# EAGLE design BNC-V003 (EAGLE 6.5.0)
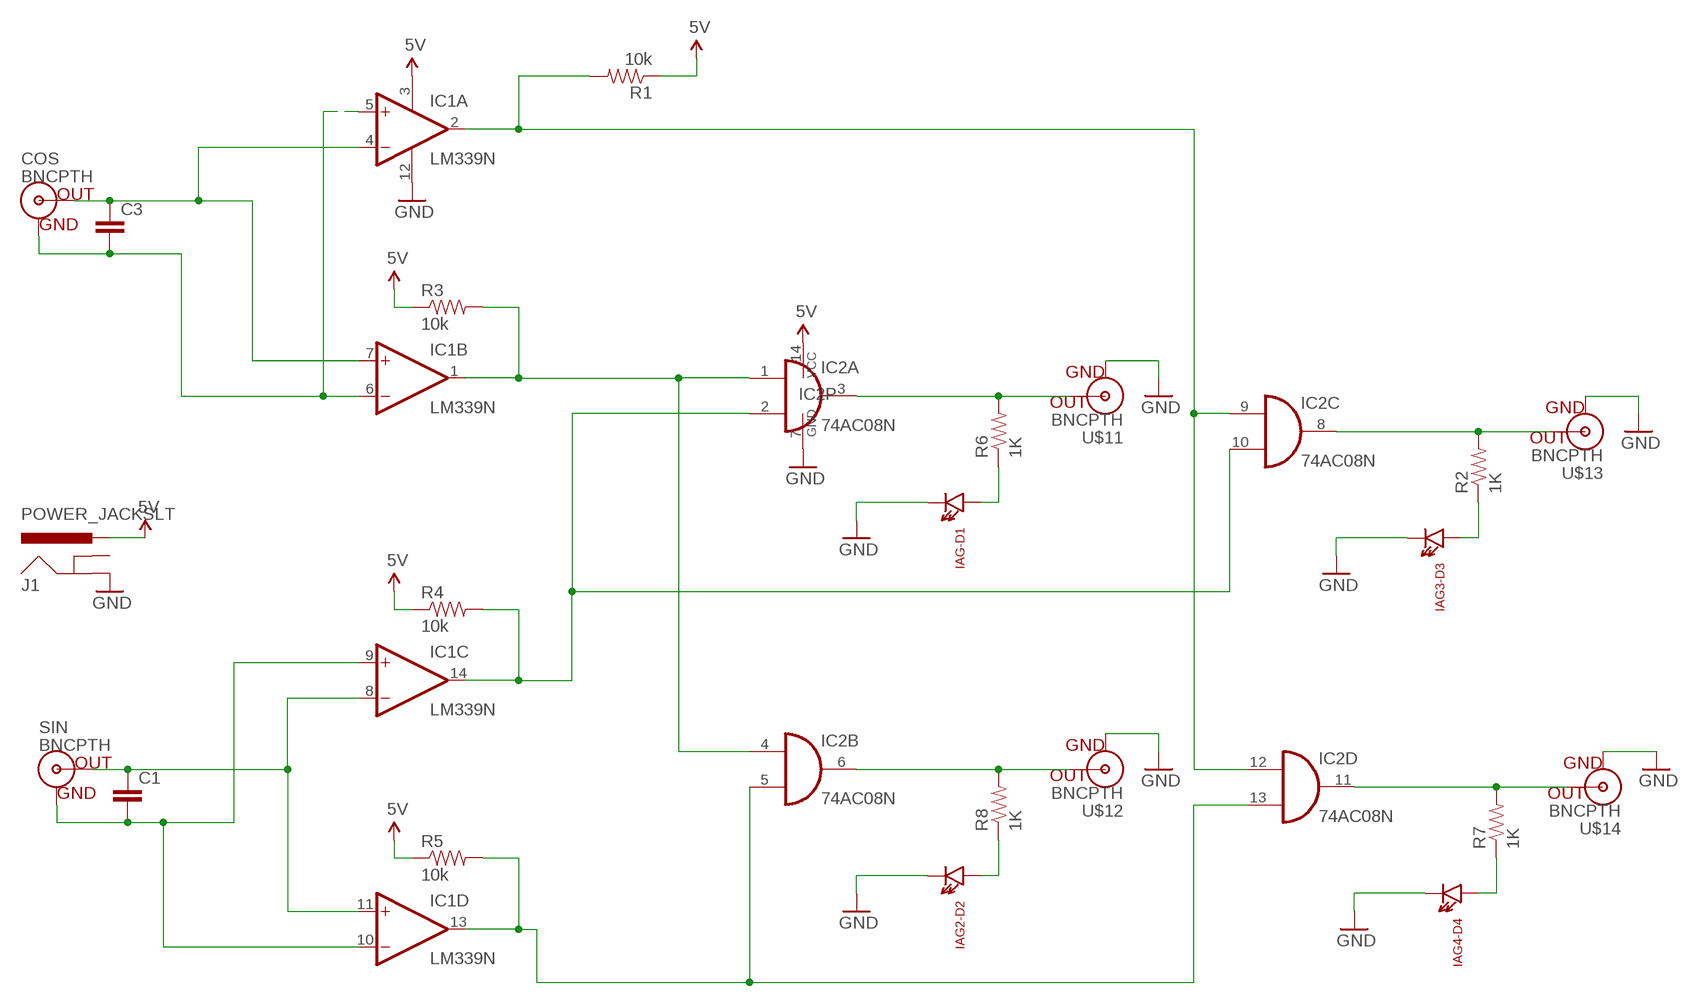
[diagram p0: schematic, sheet 1]

## Parts
C1  0.1UF-50V-20%(PTH)KIT-EZ  [CAP-PTH-SMALL-KIT]
C3  0.1UF-50V-20%(PTH)KIT-EZ  [CAP-PTH-SMALL-KIT]
COS  BNCPTH  [BNC]
IAG2-D2  LTE-302  [LTE-302]
IAG3-D3  LTE-302  [LTE-302]
IAG4-D4  LTE-302  [LTE-302]
IAG-D1  LTE-302  [LTE-302]
IC1  LM339N  [DIL14]
IC2  74AC08N  [DIL14]
J1  POWER_JACKSLT  [POWER_JACK_SLOT]
R1  10k  10KOHM-1/4W-1%(PTH)HORIZ  [AXIAL-0.3]
R2  1K  1KOHM-1/4W-1%(PTH)  [AXIAL-0.3]
R3  10k  10KOHM-1/4W-1%(PTH)HORIZ  [AXIAL-0.3]
R4  10k  10KOHM-1/4W-1%(PTH)HORIZ  [AXIAL-0.3]
R5  10k  10KOHM-1/4W-1%(PTH)HORIZ  [AXIAL-0.3]
R6  1K  1KOHM-1/4W-1%(PTH)  [AXIAL-0.3]
R7  1K  1KOHM-1/4W-1%(PTH)  [AXIAL-0.3]
R8  1K  1KOHM-1/4W-1%(PTH)  [AXIAL-0.3]
SIN  BNCPTH  [BNC]
U$11  BNCPTH  [BNC]
U$12  BNCPTH  [BNC]
U$13  BNCPTH  [BNC]
U$14  BNCPTH  [BNC]

## Nets
5V: IC1.3(P:V+) IC2.14(P:VCC) J1.PWR R1.P$1 R3.P$1 R4.P$1 R5.P$1
GND: IAG2-D2.C IAG3-D3.C IAG4-D4.C IAG-D1.C IC1.12(P:GND) IC2.7(P:GND) J1.GND@2(GND) U$11.GND U$12.GND U$13.GND U$14.GND
N$1: IC1.2(A:OUT) IC2.9(C:I0) IC2.12(D:I0) R1.P$2
N$2: IC2.11(D:O) R7.P$2 U$14.S(OUT)
N$3: IAG4-D4.A R7.P$1
N$4: IC1.1(B:OUT) IC2.1(A:I0) IC2.4(B:I0) R3.P$2
N$5: IC1.14(C:OUT) IC2.2(A:I1) IC2.10(C:I1) R4.P$2
N$6: IC1.13(D:OUT) IC2.5(B:I1) IC2.13(D:I1) R5.P$2
N$7: C3.2 COS.GND IC1.5(A:+IN) IC1.6(B:-IN)
N$8: C3.1 COS.S(OUT) IC1.4(A:-IN) IC1.7(B:+IN)
N$9: C1.1 IC1.8(C:-IN) IC1.11(D:+IN) SIN.S(OUT)
N$11: C1.2 IC1.9(C:+IN) IC1.10(D:-IN) SIN.GND
N$12: IC2.8(C:O) R2.P$2 U$13.S(OUT)
N$13: IAG3-D3.A R2.P$1
N$14: IC2.6(B:O) R8.P$2 U$12.S(OUT)
N$15: IAG2-D2.A R8.P$1
N$16: IC2.3(A:O) R6.P$2 U$11.S(OUT)
N$17: IAG-D1.A R6.P$1
Unconnected: J1.GND@1(GNDBREAK)

## Library data of the parts
C1 C3 = SparkFun-Capacitors:0.1UF-50V-20%(PTH): CAP-08370; PROD_ID: CAP-08370
COS SIN U$11-U$14 = SparkFun-Connectors:BNC: BNC Connector, Mouser Part# 5227161
IAG2-D2 IAG3-D3 IAG4-D4 IAG-D1 = SparkFun-LED:LTE-302: Through-hole side-firing 940nm IR LED
IC1 = linear:LM339: Low Power Low Offset Voltage Quad Comparators with open collector; LM139/LM239/LM339/LM2901/LM3302
IC2 = 74xx-eu:74*08: Quad 2-input AND gate
J1 = SparkFun-Connectors:POWER_JACK: Power Jack This is the standard 5.5mm barrel jack for power. The PTH is the most common, proven, reliable, footprint. The Slot footprint only works if the mill layer is transmitted to the PCB fab house so be warned. Mating wall wart : TOL-00298 (and others); PROD_ID: PRT-00119
R1 R3-R5 = SparkFun-Resistors:10KOHM-1/4W-1%(PTH): RES-12183; PROD_ID: RES-12183
R2 R6-R8 = SparkFun-Resistors:1KOHM-1/4W-1%(PTH): RES-12182; PROD_ID: RES-12182

## Board
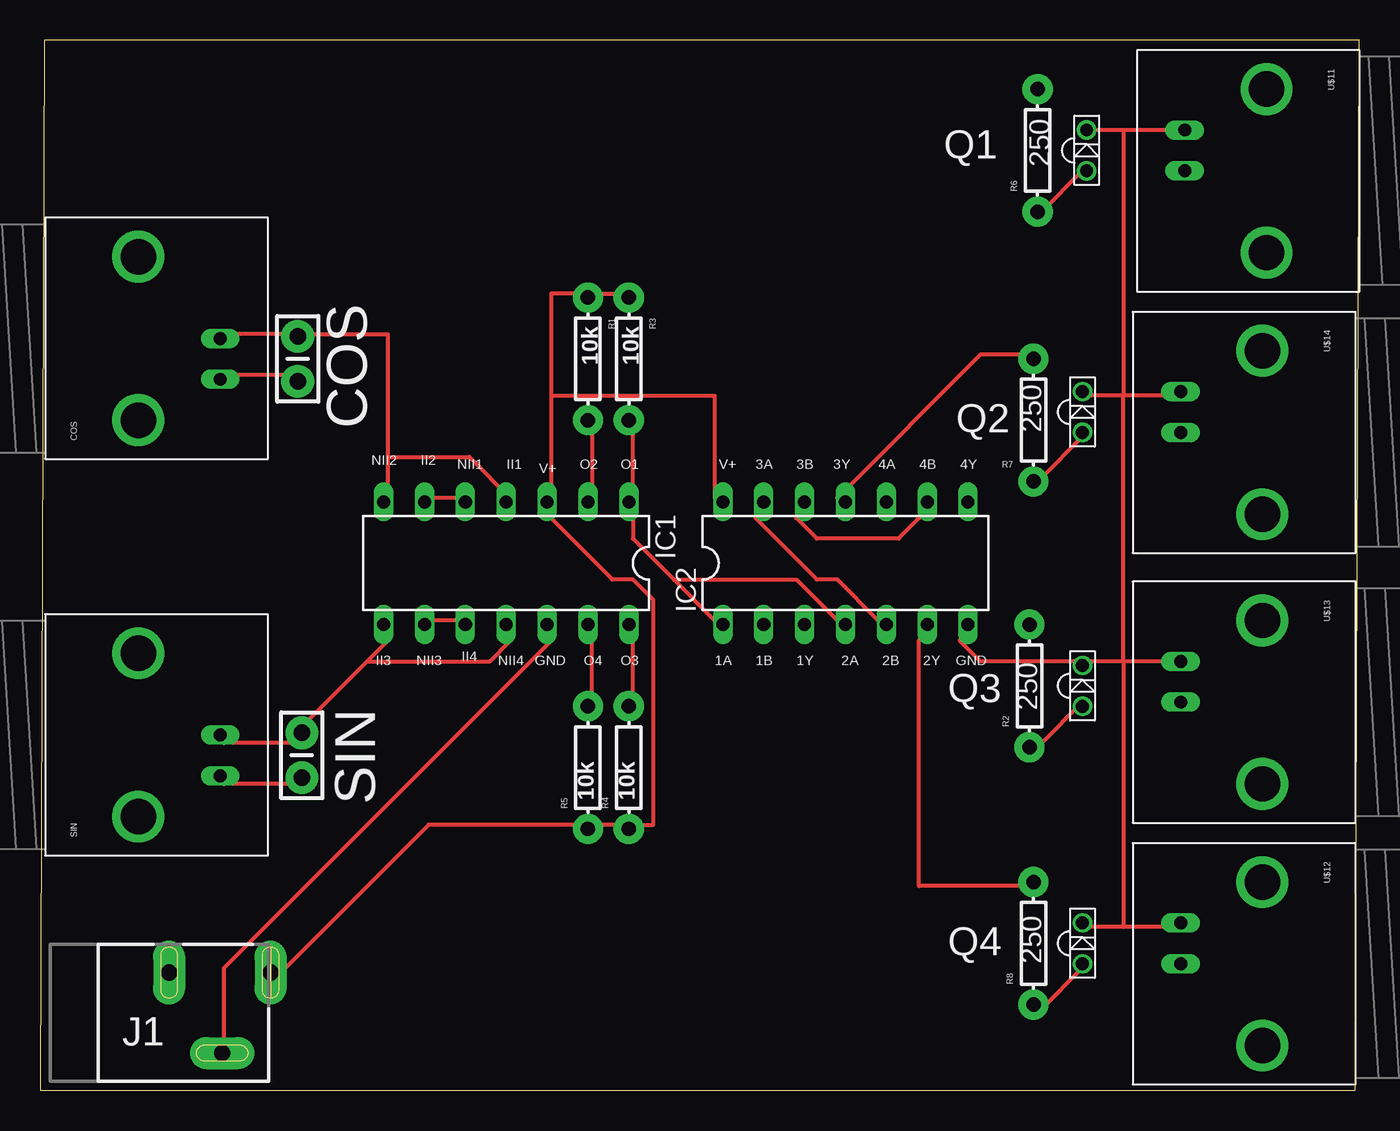
[diagram p1: board, top side]
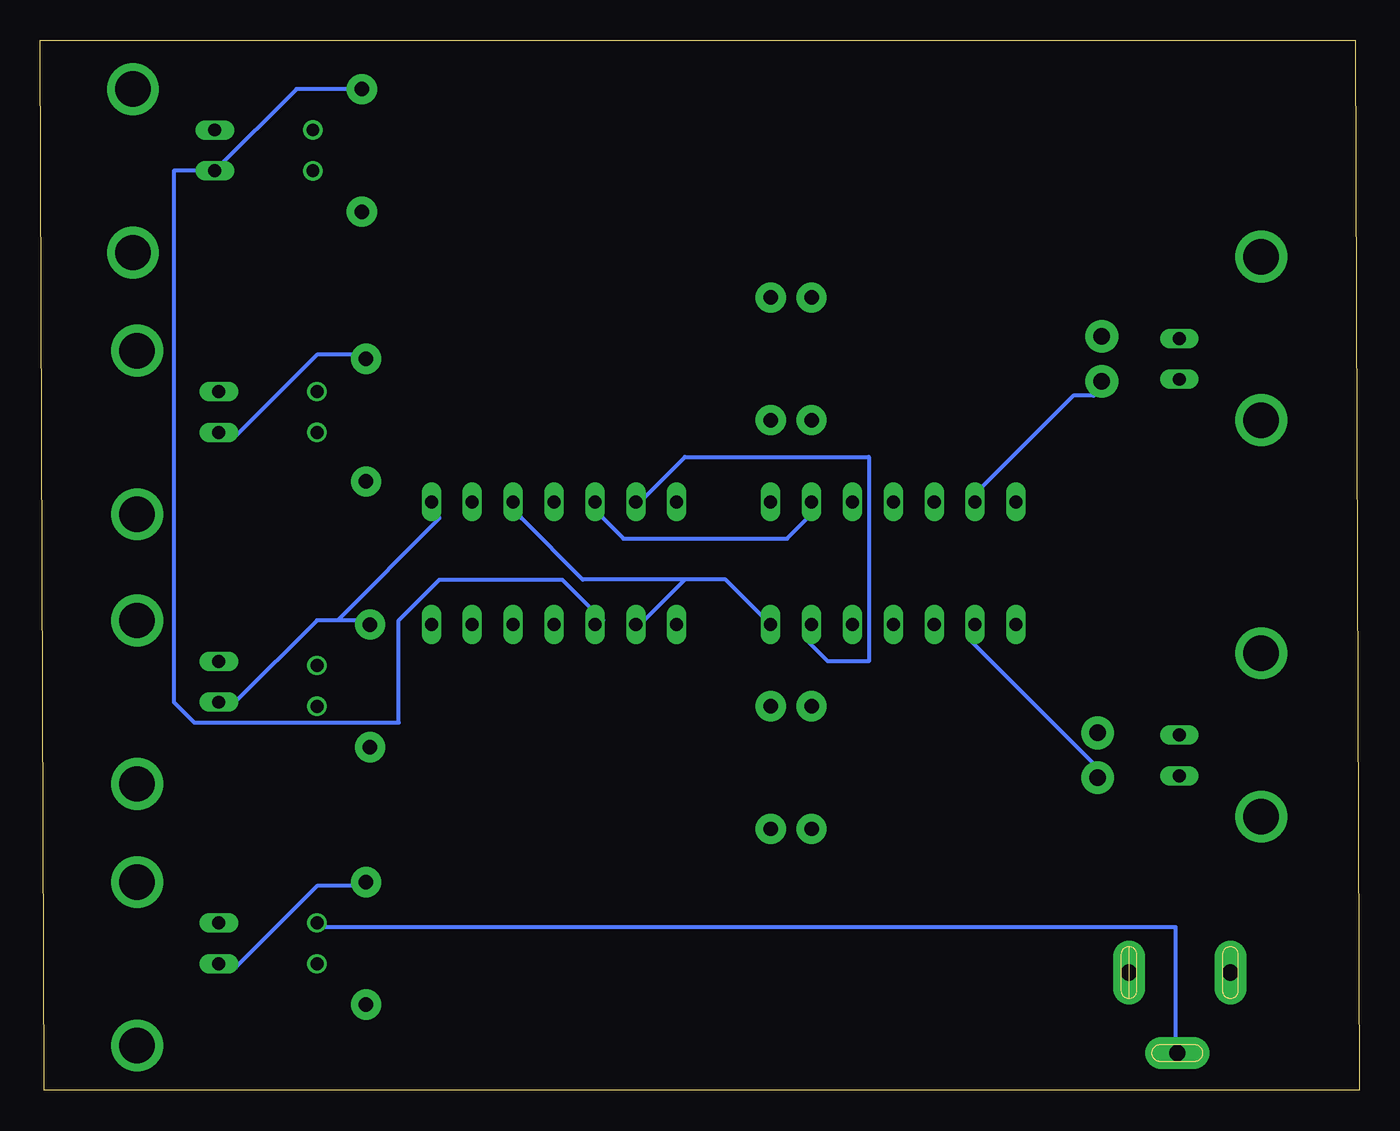
[diagram p2: board, bottom side, seen from below]

Size 81.97 x 65.27 mm. Coordinates in mm from the lower left corner, seen from the top.
Outline: 0,0 81.71,0 81.97,65.27 0.25,65.27 0,0
Copper layers (1*16): Top 0.0356mm / dielectric 1.5011mm / Bottom 0.0356mm
Design rules "LaenPCBOrder": minimum track width 6mil, minimum drill 13mil, track to track 6mil, track to pad 6mil, pad to pad 6mil, via to via 6mil, smd to smd 6mil, copper to edge 15mil, drill to drill 6mil, minimum pad ring 7mil, minimum via ring 7mil, stop-mask expansion 3mil, vias tented up to drill 0mil, thermal gap 10mil

### Footprints (pad centres in the part's own frame; a part is rotated, then mirrored left to right if it is on the bottom)
CAP-PTH-SMALL-KIT = drill 1.016 pad 2.032: 1 -1.397,0; 2 1.397,0
BNC = drill 2.2: 3 -5.08,5.08; 4 5.08,5.08 | drill 0.8 long: GND -2.54,0; S 0,0
LTE-302 = drill 0.8: A 1.27,0; C -1.27,0
DIL14 = drill 0.813 long: 1 -7.62,-3.81; 2 -5.08,-3.81; 3 -2.54,-3.81; 4 0,-3.81; 5 2.54,-3.81; 6 5.08,-3.81; 7 7.62,-3.81; 8 7.62,3.81; 9 5.08,3.81; 10 2.54,3.81; 11 0,3.81; 12 -2.54,3.81; 13 -5.08,3.81; 14 -7.62,3.81
POWER_JACK_SLOT = drill 1 pad 2 long: GND@1 2.58,7.5; GND@2 7.58,10.8; PWR 2.58,13.8
AXIAL-0.3 = drill 0.9 pad 1.88: P$1 -3.81,0; P$2 3.81,0

### Placement (x,y rotation side)
C1  16.26,20.83 270 top
C3  16,45.47 270 top
COS  11.18,46.74 90 top
IAG2-D2  64.77,9.14 270 top
IAG3-D3  64.77,25.15 270 top
IAG4-D4  64.77,42.16 270 top
IAG-D1  65.02,58.42 270 top
IC1  28.96,32.77 180 top
IC2  50.04,32.77 0 top
J1  0.51,9.91 270 top
R1  34.04,45.47 270 top
R2  61.47,25.15 90 top
R3  36.58,45.47 270 top
R4  36.58,20.07 90 top
R5  34.04,20.07 90 top
R6  61.98,58.42 90 top
R7  61.72,41.66 90 top
R8  61.72,9.14 90 top
SIN  11.18,22.1 90 top
U$11  71.12,57.15 270 top
U$12  70.87,7.87 270 top
U$13  70.87,24.13 270 top
U$14  70.87,40.89 270 top

### Tracks (layer width: path | path; a pad name or v marks a point on that pad's centre or on a via)
5V
  Top 0.254: 31.75,43.18 31.75,49.53 34.29,49.53 | 31.75,43.18 31.75,36.83 IC1.3 31.75,35.56 35.56,31.75 36.83,31.75 38.1,30.48 38.1,16.51 36.83,16.51 | 31.75,43.18 41.91,43.18 41.91,36.83 IC2.14 | 34.29,49.53 36.83,49.53 R3.P$1 | 34.29,49.53 R1.P$1 | 36.83,16.51 34.29,16.51 | 34.29,16.51 24.13,16.51 15.24,7.62 J1.PWR | 34.29,16.51 R5.P$1 | 36.83,16.51 R4.P$1
GND
  Top 0.254: 31.75,29.21 IC1.12 31.75,27.94 11.43,7.62 11.43,2.54 J1.GND@2 | 67.31,43.18 69.85,43.18 U$14.GND | 67.31,43.18 64.77,43.18 IAG4-D4.C | U$11.GND 67.31,59.69 | 67.31,59.69 IAG-D1.C 64.77,59.69 | 67.31,59.69 67.31,43.18 | 67.31,10.16 69.85,10.16 U$12.GND | 67.31,10.16 64.77,10.16 IAG2-D2.C | 57.15,29.21 IC2.7 57.15,27.94 58.42,26.67 64.77,26.67 | U$13.GND 67.31,26.67 | 67.31,26.67 64.77,26.67 | 64.77,26.67 IAG3-D3.C | 67.31,26.67 67.31,10.16 | 67.31,26.67 67.31,43.18
  Bottom 0.254: J1.GND@2 11.43,2.54 11.43,10.16 64.77,10.16 IAG2-D2.C
N$1
  Top 0.254: IC1.2 34.29,36.83 34.29,41.91 R1.P$2 | IC2.12 46.99,35.56 48.26,34.29 53.34,34.29 54.61,35.56 IC2.9
  Bottom 0.254: IC1.2 34.29,35.56 35.56,34.29 45.72,34.29 46.99,35.56 IC2.12
N$2
  Top 0.254: IC2.11 49.53,36.83 58.42,45.72 60.96,45.72 R7.P$2
  Bottom 0.254: U$14.S 69.85,40.64 64.77,45.72 62.23,45.72 R7.P$2
N$3
  Top 0.254: IAG4-D4.A 64.77,40.64 62.23,38.1 R7.P$1
N$4
  Top 0.254: 39.37,31.75 36.83,34.29 36.83,35.56 IC1.1 36.83,36.83 36.83,41.91 R3.P$2 | 39.37,31.75 41.91,29.21 IC2.1 | 39.37,31.75 46.99,31.75 49.53,29.21 IC2.4
N$5
  Top 0.254: IC1.14 36.83,27.94 36.83,24.13 R4.P$2
  Bottom 0.254: 41.91,31.75 44.45,29.21 IC2.2 | 41.91,31.75 39.37,31.75 IC1.14 | 41.91,31.75 48.26,31.75 52.07,35.56 IC2.10
N$6
  Top 0.254: IC1.13 34.29,27.94 34.29,24.13 R5.P$2 | IC2.13 44.45,35.56 48.26,31.75 49.53,31.75 52.07,29.21 IC2.5
  Bottom 0.254: IC1.13 34.29,27.94 33.02,26.67 30.48,26.67 30.48,39.37 41.91,39.37 44.45,36.83 IC2.13
N$7
  Top 0.254: IC1.6 24.13,36.83 26.67,36.83 IC1.5 | COS.GND 11.43,44.45 15.24,44.45 C3.2
  Bottom 0.254: IC1.6 24.13,36.83 17.78,43.18 16.51,43.18 C3.2
N$8
  Top 0.254: COS.S 11.43,46.99 15.24,46.99 C3.1 16.51,46.99 21.59,46.99 21.59,39.37 | 21.59,39.37 21.59,36.83 IC1.7 | 21.59,39.37 26.67,39.37 29.21,36.83 IC1.4
N$9
  Top 0.254: SIN.S 11.43,21.59 16.51,21.59 C1.1 16.51,22.86 20.32,26.67 | 20.32,26.67 21.59,27.94 IC1.8 | 20.32,26.67 27.94,26.67 29.21,27.94 IC1.11
N$11
  Top 0.254: IC1.9 24.13,29.21 26.67,29.21 IC1.10 | SIN.GND 11.43,19.05 16.51,19.05 C1.2
  Bottom 0.254: IC1.9 24.13,27.94 16.51,20.32 C1.2
N$12
  Bottom 0.254: 63.5,29.21 62.23,29.21 R2.P$2 | 63.5,29.21 64.77,29.21 69.85,24.13 U$13.S | 63.5,29.21 57.15,35.56 IC2.8
N$13
  Top 0.254: IAG3-D3.A 64.77,24.13 62.23,21.59 R2.P$1
N$14
  Top 0.254: IC2.6 54.61,27.94 54.61,12.7 60.96,12.7 R8.P$2
  Bottom 0.254: U$12.S 69.85,7.62 64.77,12.7 62.23,12.7 R8.P$2
N$15
  Top 0.254: IAG2-D2.A 64.77,7.62 62.23,5.08 R8.P$1
N$16
  Bottom 0.254: R6.P$2 66.04,62.23 U$11.S 73.66,57.15 73.66,24.13 72.39,22.86 59.69,22.86 59.69,29.21 57.15,31.75 49.53,31.75 46.99,29.21 IC2.3
N$17
  Top 0.254: IAG-D1.A 64.77,57.15 62.23,54.61 R6.P$1

### Text on the board
tPlace: Q1 | 250 | COS | Q2 | 250 | NII2 | II2 | NII1 | II1 | O2 | O1 | V+ | 3A | 3B | 3Y | 4A | 4B | 4Y | V+ | II4 | II3 | NII3 | NII4 | GND | O4 | O3 | 1A | 1B | 1Y | 2A | 2B | 2Y | GND | Q3 | 250 | SIN | Q4 | 250